# EAGLE design EPROMAdapter (EAGLE 9.4.2)
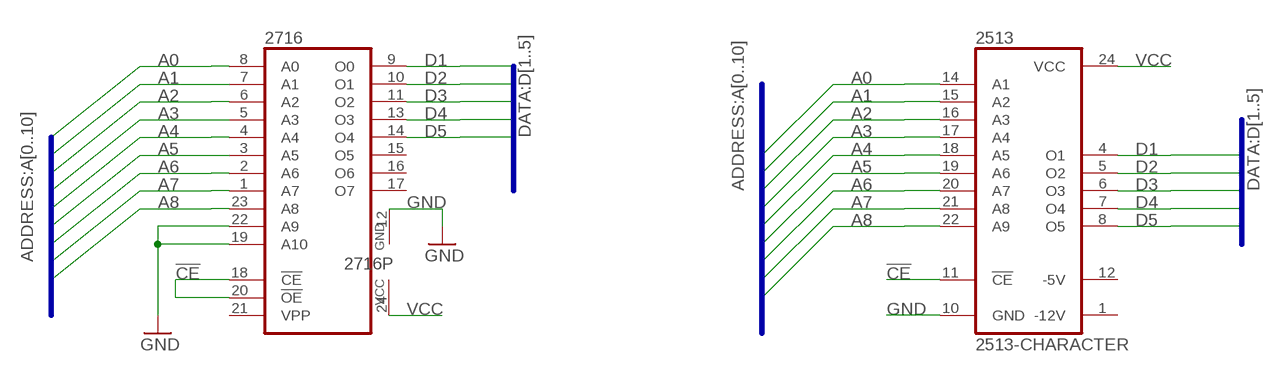
[diagram p0: schematic, sheet 1]

## Parts
2513  2513-CHARACTER  [DIL24]
2716  2716  [DIL24]

## Nets
!CE: 2513.11(!CE) 2716.18(!CE) 2716.20(!OE)
A0: 2513.14(A1) 2716.8(A0)
A1: 2513.15(A2) 2716.7(A1)
A2: 2513.16(A3) 2716.6(A2)
A3: 2513.17(A4) 2716.5(A3)
A4: 2513.18(A5) 2716.4(A4)
A5: 2513.19(A6) 2716.3(A5)
A6: 2513.20(A7) 2716.2(A6)
A7: 2513.21(A8) 2716.1(A7)
A8: 2513.22(A9) 2716.23(A8)
D1: 2513.4(O1) 2716.9(O0)
D2: 2513.5(O2) 2716.10(O1)
D3: 2513.6(O3) 2716.11(O2)
D4: 2513.7(O4) 2716.13(O3)
D5: 2513.8(O5) 2716.14(O4)
GND: 2513.10(GND) 2716.12(GND) 2716.19(A10) 2716.22(A9)
VCC: 2513.24(VCC) 2716.24(VCC)
Unconnected: 2513.1(-12V) 2513.12(-5V) 2716.15(O5) 2716.16(O6) 2716.17(O7) 2716.21(VPP)

## Buses
ADDRESS:A[0..10]
DATA:D[1..5]

## Library data of the parts
2513 = memory:2513-CHARACTER
2716 = memory:2716: MEMORY

## Board
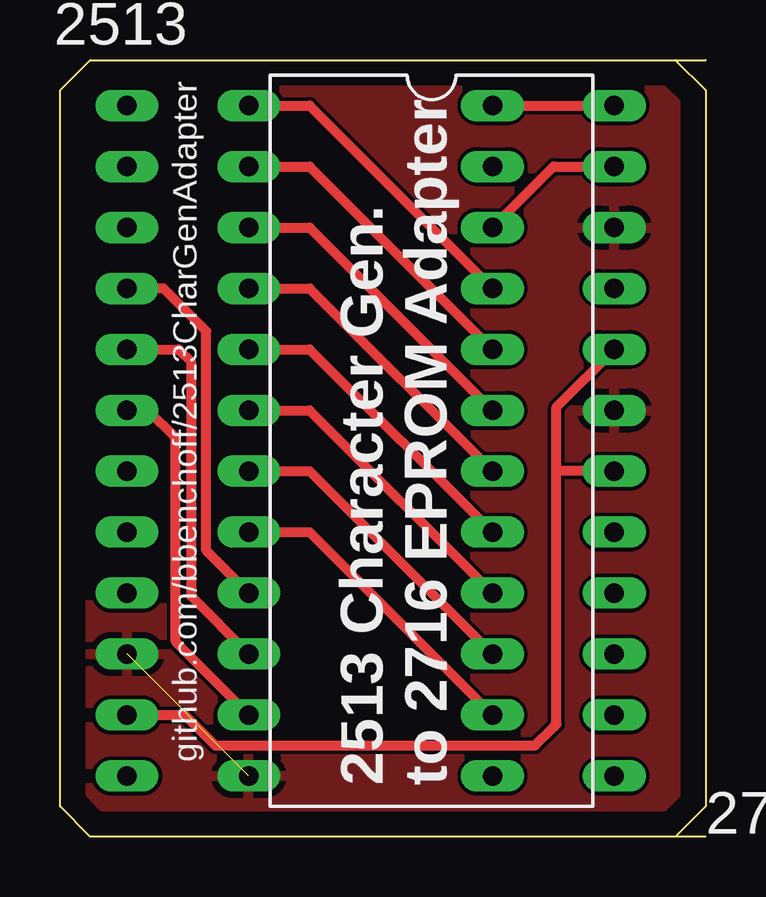
[diagram p1: board, top side]
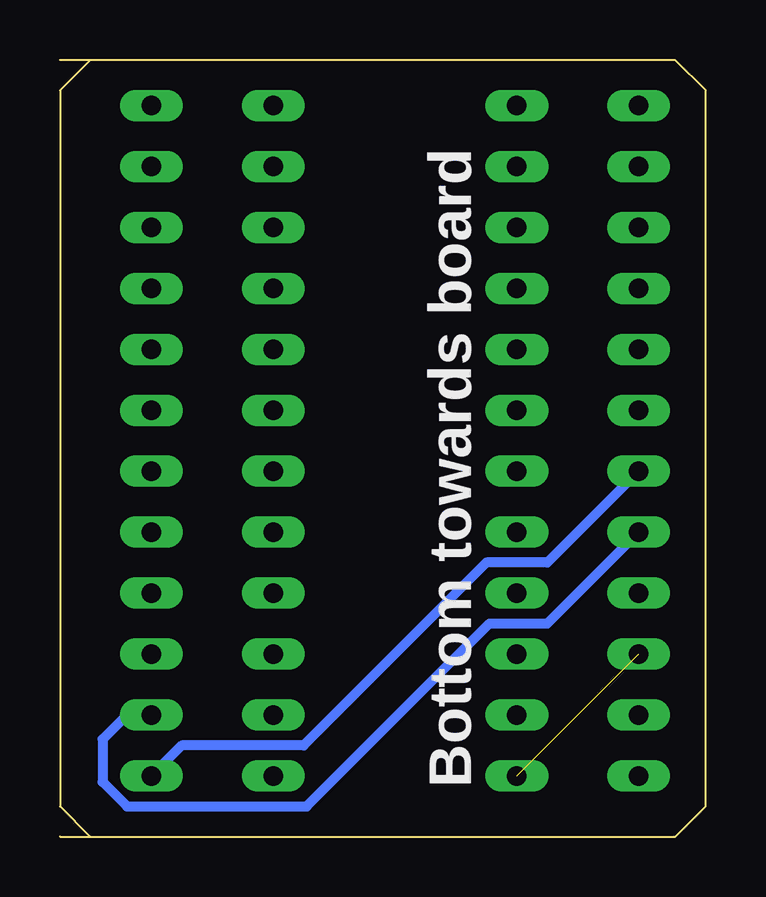
[diagram p2: board, bottom side, seen from below]

Size 26.92 x 32.38 mm. Coordinates in mm from the lower left corner, seen from the top.
Outline: 25.65,0 1.27,0 0,1.27 0,31.11 1.27,32.38 25.65,32.38 26.92,31.11 26.92,1.27 25.65,0
Copper layers (1*16): Top 0.035mm / dielectric 1.5mm / Bottom 0.035mm
Design rules "default": minimum track width 6mil, minimum drill 0.35mm, track to track 6mil, track to pad 6mil, pad to pad 6mil, via to via 6mil, smd to smd 6mil, copper to edge 40mil, drill to drill 6mil, minimum pad ring 10mil, minimum via ring 8mil, stop-mask expansion 4mil, vias tented up to drill 0mil, thermal gap 10mil
Milling: 5 lines

### Footprints (pad centres in the part's own frame; a part is rotated, then mirrored left to right if it is on the bottom)
DIL24 = drill 0.813 long: 1 -13.97,-7.62; 2 -11.43,-7.62; 3 -8.89,-7.62; 4 -6.35,-7.62; 5 -3.81,-7.62; 6 -1.27,-7.62; 7 1.27,-7.62; 8 3.81,-7.62; 9 6.35,-7.62; 10 8.89,-7.62; 11 11.43,-7.62; 12 13.97,-7.62; 13 13.97,7.62; 14 11.43,7.62; 15 8.89,7.62; 16 6.35,7.62; 17 3.81,7.62; 18 1.27,7.62; 19 -1.27,7.62; 20 -3.81,7.62; 21 -6.35,7.62; 22 -8.89,7.62; 23 -11.43,7.62; 24 -13.97,7.62

### Placement (x,y rotation side)
2513  10.41,16.51 270 top
2716  15.49,16.51 270 top

### Tracks (layer width: path | path; a pad name or v marks a point on that pad's centre or on a via)
!CE
  Top 0.406: 2513.11 5.21,5.08 6.48,3.81 17.27,3.81 19.81,3.81 20.57,4.57 20.7,4.7 20.7,15.24 | 2716.20 20.7,17.91 20.7,15.24 | 2716.18 20.7,15.24
A0
  Top 0.406: 2716.8 10.41,12.7 2513.14
A1
  Top 0.406: 2716.7 10.41,15.24 2513.15
A2
  Top 0.406: 2716.6 10.41,17.78 2513.16
A3
  Top 0.406: 2716.5 10.41,20.32 2513.17
A4
  Top 0.406: 2716.4 10.41,22.86 2513.18
A5
  Top 0.406: 2716.3 10.41,25.4 2513.19
A6
  Top 0.406: 2716.2 10.41,27.94 2513.20
A7
  Top 0.406: 2716.1 10.41,30.48 2513.21
A8
  Top 0.406: 2513.22 20.57,27.94 2716.23
D1
  Top 0.406: 2716.9 6.1,11.94 6.1,21.08 4.32,22.86 2513.4
D2
  Top 0.406: 2513.5 4.95,20.32 5.46,19.81 5.46,10.03 2716.10
D3
  Top 0.406: 2716.11 4.83,8.13 4.83,16.64 3.68,17.78 2513.6
D4
  Bottom 0.406: 2513.7 6.6,11.43 9.14,11.43 16.76,3.81 21.84,3.81 2716.13
D5
  Bottom 0.406: 2716.14 24.13,5.08 25.15,4.06 25.15,2.29 24.13,1.27 16.64,1.27 9.02,8.89 6.6,8.89 2513.8
GND  (1 unrouted)
  pour Top: -0.38,32.64 28.19,32.64 28.19,-2.54 -0.38,-2.54
VCC
  Top 0.406: 2513.24 2716.24

### Text on the board
tPlace: github.com/bbenchoff/2513CharGenAdapter | 2513 Character Gen. / to 2716 EPROM Adapter
bPlace: Bottom towards board